# Altium project slave_Project.PrjPcb
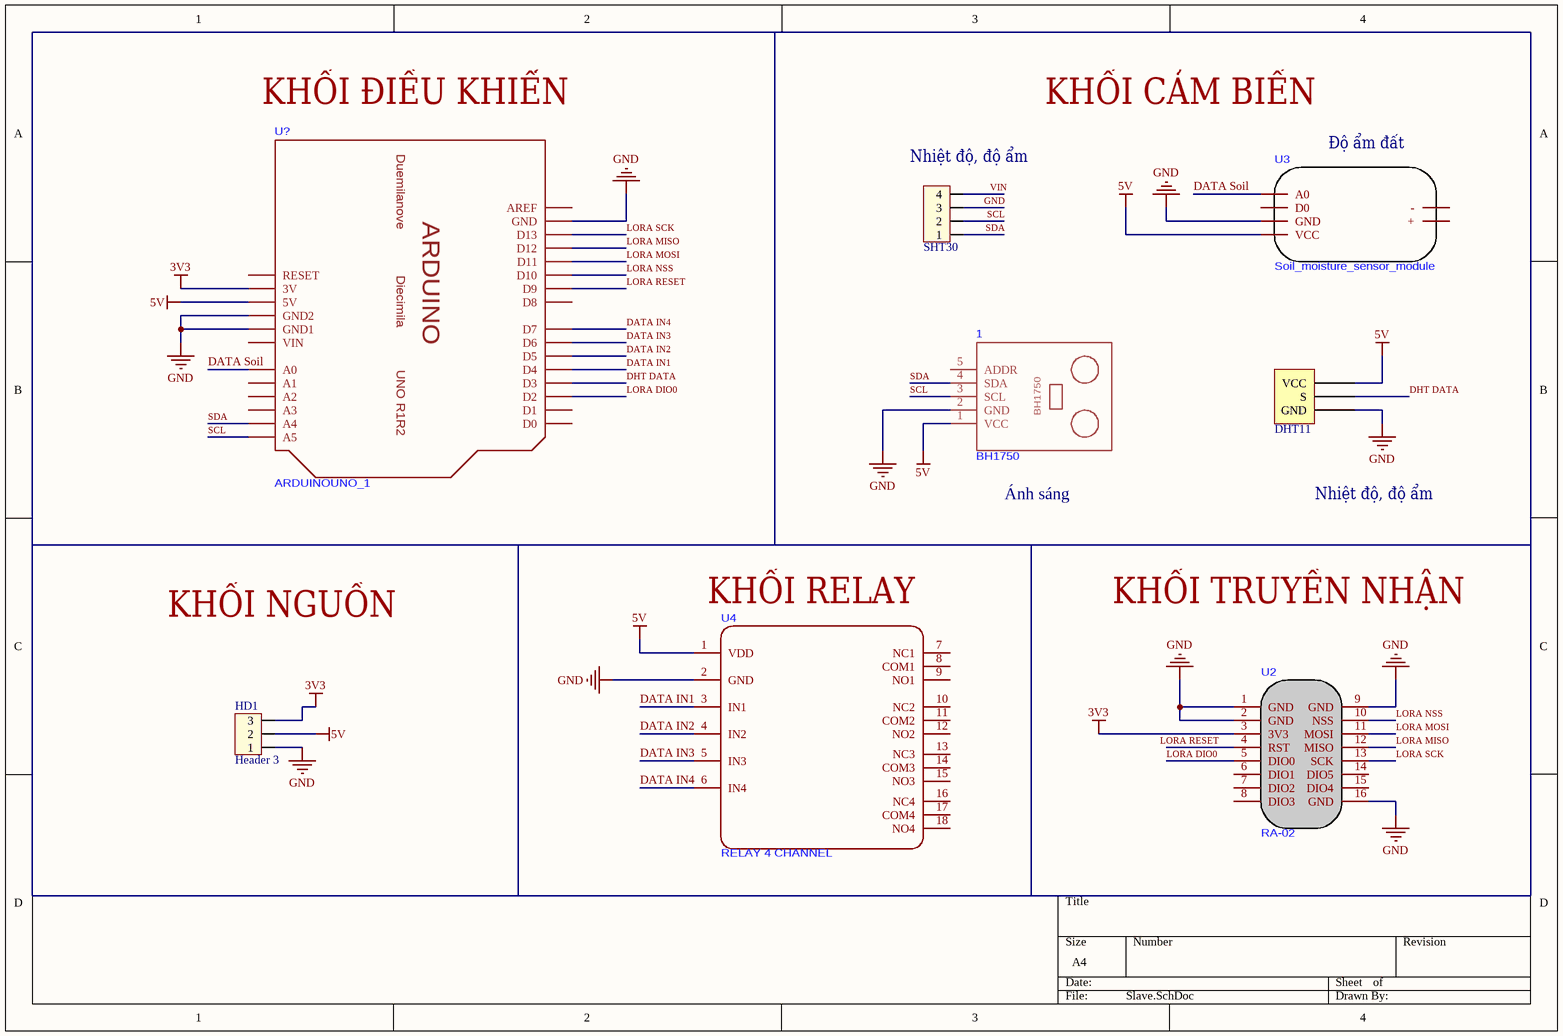
[diagram p0: Slave.SchDoc]
1 sheet, 8 parts. Net scope: global (net labels, ports and power ports of the same name join across sheets).
Board file: slave.PcbDoc

## Sheet Slave.SchDoc
size A4; SheetNumber: 1; SheetTotal: 1

### Parts
1  BH1750  [LIGHT-SENSOR-BH1750]
?  SHT30  [HED4]
DHT11  DHT11  [DHT11]  (value not drawn)
HD1  Header 3  [HED3T]
U2  RA-02  [LORA RA 02]
U3  Soil_moisture_sensor_module  [Soil]
U4  RELAY 4 CHANNEL  [RELAY 4 CHANNEL]
U?  ARDUINOUNO_1  [UNO R3]

### Nets
3V3: HD1.3 U2.3(3V3) U?.28(3V)
5V: 1.1(VCC) DHT11.1(VCC) HD1.2 U3.3(VCC) U4.1(VDD) U?.29(5V)
GND: 1.2(GND) ?.3 DHT11.4(GND) HD1.1 U2.1(GND) U2.2(GND) U2.9(GND) U2.16(GND) U3.4(GND) U4.2(GND) U?.7(GND) U?.30(GND2) U?.31(GND1)
DATA IN1: U4.3(IN1) U?.15(D4)
DATA IN2: U4.4(IN2) U?.16(D5)
DATA IN3: U4.5(IN3) U?.17(D6)
DATA IN4: U4.6(IN4) U?.18(D7)
DATA Soil: U3.6(A0) U?.19(A0)
DHT DATA: DHT11.3(S) U?.14(D3)
LORA DIO0: U2.5(DIO0) U?.13(D2)
LORA MISO: U2.12(MISO) U?.5(D12)
LORA MOSI: U2.11(MOSI) U?.4(D11)
LORA NSS: U2.10(NSS) U?.3(D10)
LORA RESET: U2.4(RST) U?.2(D9)
LORA SCK: U2.13(SCK) U?.6(D13)
SCL: 1.3(SCL) ?.2 U?.24(A5)
SDA: 1.4(SDA) ?.1 U?.23(A4)
VIN: ?.4

Not connected (* = marked no-connect by the designer): 1 5(ADDR); U2 6(DIO1) 7(DIO2) 8(DIO3) 14(DIO5) 15(DIO4); U3 2(+) 5(D0) GND(-); U4 7(NC1) 8(COM1) 9(NO1) 10(NC2) 11(COM2) 12(NO2) 13(NC3) 14(COM3) 15(NO3) 16(NC4) 17(COM4) 18(NO4); U? 1(D8) 8(AREF) 11(D0) 12(D1) 20(A1) 21(A2) 22(A3) 27(RESET) 32(VIN)

### Notes on the sheet
- KHỐI ĐIỀU KHIỂN
- KHỐI CẢM BIẾN
- Nhiệt độ, độ ẩm
- (near U3) Độ ẩm đất
- Ánh sáng
- KHỐI NGUỒN
- (near U4) KHỐI RELAY
- KHỐI TRUYỀN NHẬN
- (in symbol ARDUINOUNO_1) Duemilanove; ARDUINO; Diecimila; UNO R1R2

### Library data of the parts
? = Hed4: Header 4 (Green); Value: Header 4
HD1 = Hed3: Header 3 (Green); Value: Header 3